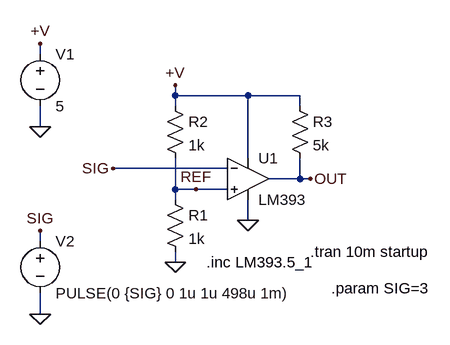
[diagram p0: schematic LM393Test.asc]
LM393Test.asc, the LTspice schematic file:
Version 4
SHEET 1 880 680
WIRE -416 48 -416 32
WIRE -208 112 -208 96
WIRE -96 112 -208 112
WIRE -16 112 -96 112
WIRE -208 128 -208 112
WIRE -16 128 -16 112
WIRE -416 160 -416 128
WIRE -96 208 -96 112
WIRE -128 224 -304 224
WIRE -16 240 -16 208
WIRE -16 240 -64 240
WIRE 0 240 -16 240
WIRE -208 256 -208 208
WIRE -176 256 -208 256
WIRE -128 256 -176 256
WIRE -208 272 -208 256
WIRE -96 304 -96 272
WIRE -416 336 -416 320
WIRE -208 368 -208 352
WIRE -416 448 -416 416
FLAG -416 160 0
FLAG -416 32 +V
FLAG -208 96 +V
FLAG -96 304 0
FLAG -208 368 0
FLAG 0 240 OUT
FLAG -416 448 0
FLAG -416 320 SIG
FLAG -304 224 SIG
FLAG -176 256 REF
SYMBOL voltage -416 32 R0
SYMATTR InstName V1
SYMATTR Value 5
SYMBOL res -224 256 R0
SYMATTR InstName R1
SYMATTR Value 1k
SYMBOL res -224 112 R0
SYMATTR InstName R2
SYMATTR Value 1k
SYMBOL Opamps\\opamp2 -96 176 R0
SYMATTR InstName U1
SYMATTR Value LM393
SYMBOL voltage -416 320 R0
SYMATTR InstName V2
SYMATTR Value PULSE(0 {SIG} 0 1u 1u 498u 1m)
SYMBOL res -32 112 R0
SYMATTR InstName R3
SYMATTR Value 5k
TEXT 0 352 Left 2 !.tran 10m startup
TEXT -160 368 Left 2 !.inc LM393.5_1
TEXT 32 408 Left 2 !.param SIG=3

The netlist it stands for:
* LM393Test.asc
V1 +V 0 5
R1 REF 0 1k
R2 +V REF 1k
XU1 REF SIG +V 0 OUT LM393  ; pins In+ In- V+ V- OUT
V2 SIG 0 PULSE(0 {SIG} 0 1u 1u 498u 1m)
R3 +V OUT 5k
.tran 10m startup
.inc LM393.5_1
.param SIG=3
.backanno
.end